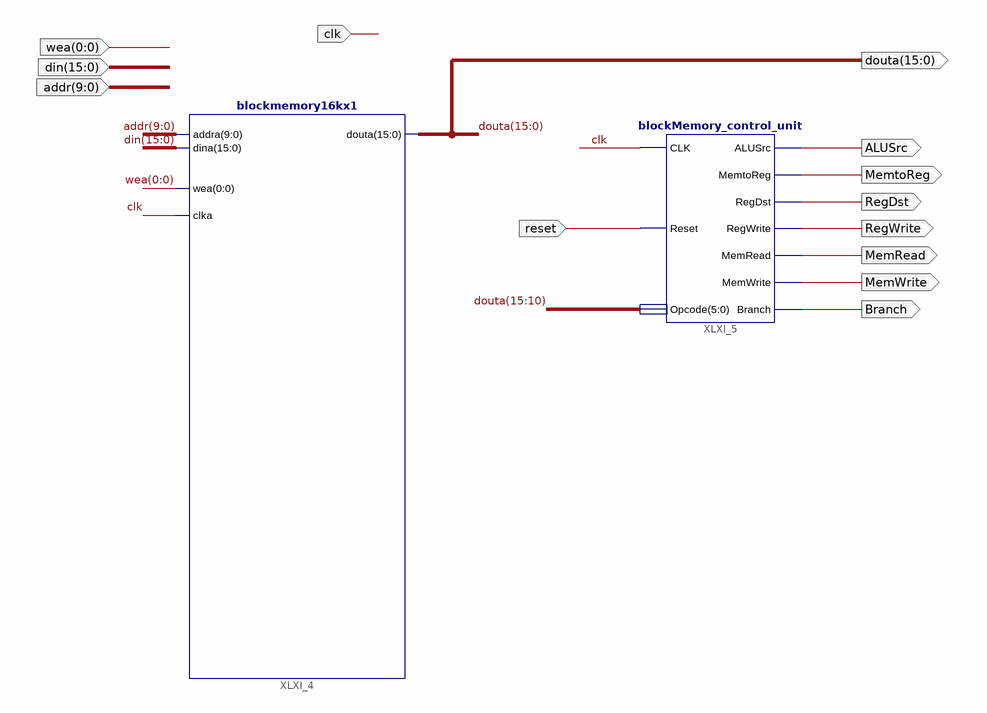
[diagram p0: schematic sheet 1]
// Xilinx ISE schematic memory.sch (spartan3adsp) as structural Verilog: 2 symbols, 13 ports
module memory (
  input  clk,
  input  [9:0] addr,
  input  [15:0] din,
  input  [0:0] wea,
  input  reset,
  output [15:0] douta,
  output ALUSrc,
  output MemtoReg,
  output RegDst,
  output RegWrite,
  output MemRead,
  output MemWrite,
  output Branch
);

  blockmemory16kx1 XLXI_4 (.addra(addr), .dina(din), .wea(wea[0]), .clka(clk), .douta(douta));
  blockMemory_control_unit XLXI_5 (
    .CLK(clk), .Reset(reset), .Opcode(douta[15:10]), .ALUSrc(ALUSrc), .MemtoReg(MemtoReg), .RegDst(RegDst),
    .RegWrite(RegWrite), .MemRead(MemRead), .MemWrite(MemWrite), .Branch(Branch));
endmodule
